# Altium project Carte_Alim_2019.PrjPcb (part 2 of 2)

## Sheet Carte_Alim_2019_CLAV.SchDoc
size A4; Author: Audran; CompanyName: Goldorak; Address1: Electrolab; Address2: 52 rue Paul Lescop; Address3: 92000 Nanterre; DocumentNumber: 5; SheetNumber: 5; SheetTotal: 5; ProjectName: Cartes_2017
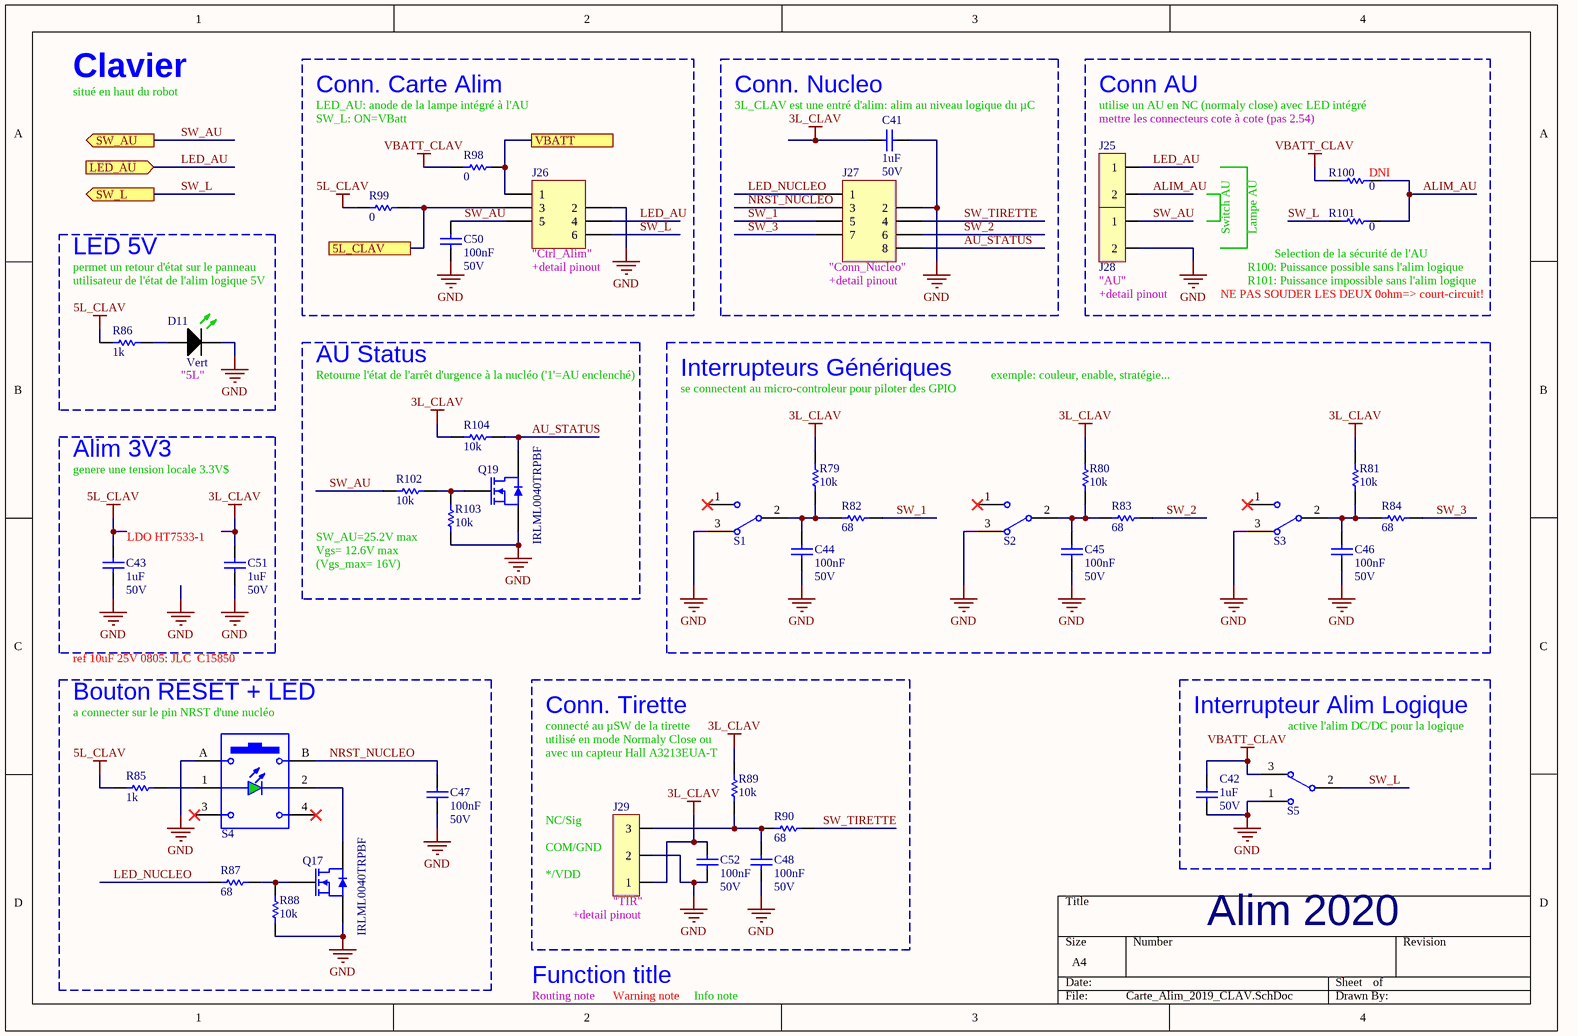
[diagram p4: Carte_Alim_2019_CLAV.SchDoc]

### Parts
C41  1uF  RatedVoltage: 50V  [WCAP-CSGP_0805, 2x1.25x1.25]
C42  1uF  RatedVoltage: 50V  [WCAP-CSGP_0805, 2x1.25x1.25]
C43  1uF  RatedVoltage: 50V  [WCAP-CSGP_0805, 2x1.25x1.25]
C44  100nF  RatedVoltage: 50V  [WCAP-CSGP_0603, 1.6x0.8x0.8]
C45  100nF  RatedVoltage: 50V  [WCAP-CSGP_0603, 1.6x0.8x0.8]
C46  100nF  RatedVoltage: 50V  [WCAP-CSGP_0603, 1.6x0.8x0.8]
C47  100nF  RatedVoltage: 50V  [WCAP-CSGP_0603, 1.6x0.8x0.8]
C48  100nF  RatedVoltage: 50V  [WCAP-CSGP_0603, 1.6x0.8x0.8]
C50  100nF  RatedVoltage: 50V  [WCAP-CSGP_0603, 1.6x0.8x0.8]
C51  1uF  RatedVoltage: 50V  [WCAP-CSGP_0805, 2x1.25x1.25]
C52  100nF  RatedVoltage: 50V  [WCAP-CSGP_0603, 1.6x0.8x0.8]
D11  Vert  [SMCW_0603]
J25  22-03-2021  [22-03-2021]  (value not drawn)
J26  690367280676  [690367280676]  (value not drawn)
J27  690367280876  [690367280876]  (value not drawn)
J28  22-03-2021  [22-03-2021]  (value not drawn)
J29  22-03-2031  [22-03-2031]  (value not drawn)
Q17  IRLML0040TRPBF  [SOT-23]
Q19  IRLML0040TRPBF  [SOT-23]
R79  value 10k  [RESC1608X06N]  (hidden comment: RC0603FR-0710KL)
R80  value 10k  [RESC1608X06N]  (hidden comment: RC0603FR-0710KL)
R81  value 10k  [RESC1608X06N]  (hidden comment: RC0603FR-0710KL)
R82  value 68  [RESC1608X06N]  (hidden comment: RC0603FR-0768RL)
R83  value 68  [RESC1608X06N]  (hidden comment: RC0603FR-0768RL)
R84  value 68  [RESC1608X06N]  (hidden comment: RC0603FR-0768RL)
R85  value 1k  [RESC1608X06N]  (hidden comment: RC0603FR-071KL)
R86  value 1k  [RESC1608X06N]  (hidden comment: RC0603FR-071KL)
R87  value 68  [RESC1608X06N]  (hidden comment: RC0603FR-0768RL)
R88  value 10k  [RESC1608X06N]  (hidden comment: RC0603FR-0710KL)
R89  value 10k  [RESC1608X06N]  (hidden comment: RC0603FR-0710KL)
R90  value 68  [RESC1608X06N]  (hidden comment: RC0603FR-0768RL)
R98  value 0  [RESC1608X06N]  (hidden comment: RC0603FR-070RL)
R99  value 0  [RESC1608X06N]  (hidden comment: RC0603FR-070RL)
R100  value 0  [RESC1608X06N]  (hidden comment: RC0603FR-070RL)
R101  value 0  [RESC1608X06N]  (hidden comment: RC0603FR-070RL)
R102  value 10k  [RESC1608X06N]  (hidden comment: RC0603FR-0710KL)
R103  value 10k  [RESC1608X06N]  (hidden comment: RC0603FR-0710KL)
R104  value 10k  [RESC1608X06N]  (hidden comment: RC0603FR-0710KL)
S1  OS102011MS2QN1  [SW_OS102011MS2QN1]  (value not drawn)
S2  OS102011MS2QN1  [SW_OS102011MS2QN1]  (value not drawn)
S3  OS102011MS2QN1  [SW_OS102011MS2QN1]  (value not drawn)
S4  440GS67082622  [440xx67082622]  (value not drawn)
S5  OS102011MS2QN1  [SW_OS102011MS2QN1]  (value not drawn)

### Blocks framed on the sheet
Conn. Carte Alim: C50 J26 R98 R99
Conn. Nucleo: C41 J27
Conn AU: J25 J28 R100 R101
LED 5V: D11 R86
AU Status: Q19 R102-R104
Interrupteurs Génériques: C44-C46 R79-R84 S1-S3
Alim 3V3: C43 C51
Bouton RESET + LED: C47 Q17 R85 R87 R88 S4
Conn. Tirette: C48 C52 J29 R89 R90
Interrupteur Alim Logique: C42 S5

### Ports
5L_CLAV, LED_AU (in), SW_AU (out), SW_L (out), VBATT

### Nets
3L_CLAV: C41.2 C51.1 C52.1 J29.1 R79.2 R80.2 R81.2 R89.2 R104.2
5L: J26.3 R99.1 ; port 5L_CLAV
5L_CLAV: C43.1 R85.1 R86.1 R99.2
GND: C41.1 C42.1 C43.2 C44.2 C45.2 C46.2 C47.2 C48.2 C50.2 C51.2 C52.2 D11.1(C) J26.2 J27.2 J28.2 J29.2 Q17.2(S) Q19.2(S) R88.1 R103.1 S1.3 S2.3 S3.3 S4.A S5.1
VBATT: J26.1 R98.1 ; port VBATT
VBATT_CLAV: C42.2 R98.2 R100.1 S5.3
ALIM_AU: J25.2 R100.2 R101.2
AU_STATUS: J27.8 Q19.3(D) R104.1
LED_AU: J25.1 J26.4 ; port LED_AU
LED_NUCLEO: J27.1 R87.1
NRST_NUCLEO: C47.1 J27.3 S4.B
SW_1: J27.5 R82.2
SW_2: J27.6 R83.2
SW_3: J27.7 R84.2
SW_AU: C50.1 J26.5 J28.1 R102.2 ; port SW_AU
SW_L: J26.6 R101.1 S5.2 ; port SW_L
SW_TIRETTE: J27.4 R90.2
NetC44_1: C44.1 R79.1 R82.1 S1.2
NetC45_1: C45.1 R80.1 R83.1 S2.2
NetC46_1: C46.1 R81.1 R84.1 S3.2
NetC48_1: C48.1 J29.3 R89.1 R90.1
NetD11_2: D11.2(A) R86.2
NetQ17_1: Q17.1(G) R87.2 R88.2
NetQ17_3: Q17.3(D) S4.2
NetQ19_1: Q19.1(G) R102.1 R103.2
NetR85_2: R85.2 S4.1

Not connected (* = marked no-connect by the designer): S1 1*; S2 1*; S3 1*; S4 3* 4*

### Notes on the sheet
- Clavier
- situé en haut du robot
- LED_AU: anode de la lampe intégré à l'AU
- (near C41) 3L_CLAV est une entré d'alim: alim au niveau logique du µC
- utilise un AU en NC (normaly close) avec LED intégré
- SW_L: ON=VBatt
- mettre les connecteurs cote à cote (pas 2.54)
- (near R100) DNI
- Switch AU
- Lampe AU
- permet un retour d'état sur le panneau
- utilisateur de l'état de l'alim logique 5V
- (near J26) "Ctrl_Alim"
- (near J26) +detail pinout
- (near J27) "Conn_Nucleo"
- (near J27) +detail pinout
- (near J28) "AU"
- (near J28) +detail pinout
- NE PAS SOUDER LES DEUX 0ohm=> court-circuit!
- (near R101) R100: Puissance possible sans l'alim logique
- R101: Puissance impossible sans l'alim logique
- (near R101) Selection de la sécurité de l'AU
- (near D11) "5L"
- Retourne l'état de l'arrêt d'urgence à la nucléo ('1'=AU enclenché)
- exemple: couleur, enable, stratégie...
- se connectent au micro-controleur pour piloter des GPIO
- genere une tension locale 3.3V$
- (near C43) LDO HT7533-1
- SW_AU=25.2V max
- Vgs= 12.6V max
- (Vgs_max= 16V)
- (near S4) a connecter sur le pin NRST d'une nucléo
- ref 10uF 25V 0805: JLC  C15850
- (near R89) connecté au µSW de la tirette
- (near R89) utilisé en mode Normaly Close ou
- (near R89) avec un capteur Hall A3213EUA-T
- (near S5) active l'alim DC/DC pour la logique
- (near J29) COM/GND
- NC/Sig
- */VDD
- (near J29) +detail pinout
- (near J29) "TIR"
- Function title
- Alim 2020
- Routing note
- Warning note
- Info note
- Title
- Size:
- Date:
- A4
- Number:
- Time:
- Revision:
- Sheet
- of
- File:

### Library data of the parts
C41-C43 C51 = WCAP-CSGP, 885012207103: CAP CER 1uF 50V X7R 0805; Manufacturer: Wurth Elektronik; PublishedDate: Aug 2016; ComponentLink1Description: Manufacturer; ComponentLink1URL: http://www.we-online.de; ComponentLink2Description: Datasheet; ComponentLink2URL: http://katalog.we-online.com/pbs/datasheet/885012207103.pdf; Manufacturer Part Number: 885012207103; Value: 1uF; Size: 0805; CeramicType: X7R
  C43 C51: Supplier 2: JLCPCB; Supplier Part Number 2: C28323
C44-C48 C50 C52 = WCAP-CSGP, 885012206095: CAP CER 100nF 50V X7R 0603; Manufacturer: Wurth Elektronik; PublishedDate: Aug 2016; ComponentLink1Description: Manufacturer; ComponentLink1URL: http://www.we-online.de; ComponentLink2Description: Datasheet; ComponentLink2URL: http://katalog.we-online.com/pbs/datasheet/885012206095.pdf; Value: 100nF; Size: 0603; CeramicType: X7R; Manufacturer Part Number: 885012206095
D11 = WL-SMCW 0603  150060GS75000: SMD mono-color Chip LED, WL-SMCW, Green; Manufacturer 1: Würth Elektronik eiSos GmbH; Manufacturer Part Number: 150060GS75000; ComponentLink1Description: Manufacturer; ComponentLink1URL: http://www.we-online.de; Created by: Christin Otto; Created Date: June 2013; ComponentLink2Description: Datasheet; ComponentLink2URL: http://katalog.we-online.com/led/datasheet/150060GS75000.pdf; Color: Green; Value: Vert; Supplier 1: Farnell; Supplier Part Number 1: 2322070
J25 J28 = 22-03-2021: Manufacturer 1: MOLEX; Supplier 1: Farnell; Supplier Part Number 1: 9731075; Manufacturer Part Number: 22-03-2021; Pricing: 10=0.189, 100=0.147, 200=0.119, 500=0.108, 1000=0.088, 2500=0.08, 2500=0.0711, 20000=0.064 (EUR); ComponentLink1URL: http://www.farnell.com/cad/1533907.pdf; ComponentLink1Description: http://www.farnell.com/cad/1533907.pdf; ComponentLink2URL: http://www.farnell.com/datasheets/1791308.pdf; ComponentLink2Description: http://www.farnell.com/datasheets/1791308.pdf
J26 = 690367280676: WR-MM 6p Female SMT Connector with Polarization; Manufacturer: Wurth Electronics Inc.; Value: 6; ComponentLink1Description: Datasheet; ComponentLink1URL: http://katalog.we-online.de/em/datasheet/69036728xx76.pdf; Manufacturer Part Number: 690367280676; Supplier 1: Farnell; Supplier Part Number 1: 1641849
J27 = 690367280876: WR-MM 8p Female SMT Connector with Polarization; Manufacturer: Wurth Electronics Inc.; Value: 8; Manufacturer Part Number: 690367280876; ComponentLink1Description: Datasheet; ComponentLink1URL: http://katalog.we-online.de/em/datasheet/69036728xx76.pdf; Supplier 1: Farnell; Supplier Part Number 1: 1641850
J29 = 22-03-2031: Manufacturer 1: MOLEX; Supplier 1: Farnell; Supplier Part Number 1: 9731083; Manufacturer Part Number: 22-03-2031; Pricing: 10=0.27, 100=0.242, 200=0.22, 500=0.208, 1000=0.202, 2500=0.196 (EUR); ComponentLink1URL: http://www.farnell.com/cad/1533907.pdf; ComponentLink1Description: http://www.farnell.com/cad/1533907.pdf; ComponentLink2URL: http://www.farnell.com/datasheets/1785732.pdf; ComponentLink2Description: http://www.farnell.com/datasheets/1785732.pdf
Q17 Q19 = IRLML0040: MOSFET N 40V 3.6A SOT23; Manufacturer: INTERNATIONAL RECTIFIER; Supplier 1: Farnell; Supplier Part Number 1: 1831088; Manufacturer Part Number: IRLML0040TRPBF; ComponentLink1Description: http://www.irf.com/product-info/datasheets/data/irlml0040pbf.pdf; ComponentLink1URL: http://www.irf.com/product-info/datasheets/data/irlml0040pbf.pdf
R79-R81 R88 R89 R102-R104 = RC0603FR-0710KL: RES SMD 10K OHM 1% 1/10W 0603; Manufacturer: Yageo; Power: 100mW; Vmax: 50V; Manufacturer Part Number: RC0603FR-0710KL; Type: Thick Film; ComponentLink1Description: Manufacturer; ComponentLink1URL: http://www.yageo.com/NewPortal/_en/index.jsp; ComponentLink2Description: Datasheet; ComponentLink2URL: http://www.farnell.com/datasheets/2167052.pdf; Supplier 1: Farnell; Supplier Part Number 1: 9238603; Precision: ±1%
R82-R84 R87 R90 = RC0603FR-0768RL: RES SMD 68 OHM 1% 1/10W 0603; Manufacturer: Yageo; Power: 100mW; Vmax: 50V; Manufacturer Part Number: RC0603FR-0768RL; Type: Thick Film; ComponentLink1Description: Manufacturer; ComponentLink1URL: http://www.yageo.com/NewPortal/_en/index.jsp; ComponentLink2Description: Datasheet; ComponentLink2URL: http://www.farnell.com/datasheets/1868787.pdf; Supplier 1: Farnell; Supplier Part Number 1: 9238344; Precision: ±1%
R85 R86 = RC0603FR-071KL: RES SMD 1K OHM 1% 1/10W 0603; Manufacturer: Yageo; Power: 100mW; Vmax: 50V; Manufacturer Part Number: RC0603FR-071KL; Type: Thick Film; ComponentLink1Description: Manufacturer; ComponentLink1URL: http://www.yageo.com/NewPortal/_en/index.jsp; ComponentLink2Description: Datasheet; ComponentLink2URL: http://www.farnell.com/datasheets/2167052.pdf; Precision: ±1%; Supplier 1: Farnell; Supplier Part Number 1: 9238484
R98-R101 = RC0603FR-070RL: RES SMD 0 OHM 1% 1/10W 0603; Manufacturer: Yageo; Power: 100mW; Vmax: 50V; ComponentLink1Description: Manufacturer; ComponentLink1URL: http://www.yageo.com/NewPortal/_en/index.jsp; ComponentLink2Description: Datasheet; ComponentLink2URL: http://www.farnell.com/datasheets/2167052.pdf; Manufacturer Part Number: RC0603FR-070RL; Type: Thick Film; Supplier 1: Farnell; Precision: ±1%; Supplier Part Number 1: 2309106; Supplier 2: JLCPCB; Supplier Part Number 2: C21189
S1-S3 S5 = OS102011MS2QN1: SWITCH SLIDE SPDT 0.1A 12V (500VDC max); Manufacturer: C & K COMPONENTS; Supplier 1: Farnell; Supplier Part Number 1: 1201430; Manufacturer Part Number: OS102011MS2QN1; ComponentLink2URL: https://www.ckswitches.com/media/1428/os.pdf; ComponentLink2Description: datasheet; ComponentLink1Description: manufacturer; ComponentLink1URL: https://www.ckswitches.com/products/switches/product-details/Slide/OS/OS102011MS2QN1/
S4 = 440GS67082622: WS-TATL Illuminated THT Tact Switch, Green; Manufacturer: Wurth Elektronik; Operation Force: 220gf; Rated Voltage: 12VDC; Rated Current: 50mA; ComponentLink1Description: Manufacturer; ComponentLink1URL: https://www.we-online.com/catalog/en/TATL_12X12_THT/?sq=440GS67082622#440GS67082622; ComponentLink2Description: Datasheet; ComponentLink2URL: https://katalog.we-online.com/em/datasheet/440GS67082622.pdf; Manufacturer Part Number: 440GS67082622; Emitting Color: Green; Supplier 1: Farnell; Supplier Part Number 1: 2402381

## Nets that join several sheets
5L: Carte_Alim_2019_TOP (J3.3 R12.2), Carte_Alim_2019_CAP (FB8.1), Carte_Alim_2019_TRACO (7 pins), Carte_Alim_2019_CLAV (J26.3 R99.1)
5P: Carte_Alim_2019_TOP (R10.2), Carte_Alim_2019_TRACO (7 pins)
12V: Carte_Alim_2019_TOP (R11.2), Carte_Alim_2019_TRACO (8 pins)
GND: Carte_Alim_2019_TOP (23 pins), Carte_Alim_2019_CAP (36 pins), Carte_Alim_2019_TRACO (37 pins), Carte_Alim_2019_MOT (40 pins), Carte_Alim_2019_CLAV (25 pins)
PWR: Carte_Alim_2019_TOP (10 pins), Carte_Alim_2019_CAP (FB7.1), Carte_Alim_2019_MOT (17 pins)
VBATT: Carte_Alim_2019_TOP (13 pins), Carte_Alim_2019_TRACO (6 pins), Carte_Alim_2019_CLAV (J26.1 R98.1)
LED_AU: Carte_Alim_2019_TOP (J3.4 Q6.3 R9.1), Carte_Alim_2019_CLAV (J25.1 J26.4)
SW_AU: Carte_Alim_2019_TOP (J3.5 R3.1), Carte_Alim_2019_TRACO (D2.1 D4.1), Carte_Alim_2019_CLAV (C50.1 J26.5 J28.1 R102.2)
SW_L: Carte_Alim_2019_TOP (J3.6), Carte_Alim_2019_TRACO (D6.1), Carte_Alim_2019_CLAV (J26.6 R101.1 S5.2)

## Assembly variants
PROD: not fitted C28 FB8 J1 J2 J4 J8 J9 J10 J11 J12 J13 J14 J17 J18 J25 J28 J33 J37 R25 R45 R51 R60 R72 R92 R94 R96 R100
BASE: not fitted C8 C9 C10 C11 C12 C13 C14 C15 C16 C17 C18 C19 C27 C28 D2 D3 D4 D5 D6 D7 DC1 DC2 DC3 FB7 FB8 J1 J2 J4 J5 J6 J7 J8 J9 J10 J11 J12 J13 J14 J17 J18 J25 J28 J31 J32 J33 J37 Q3 Q4 Q5 Q11 Q12 Q13 Q14 Q15 Q16 R17 R18 R19 R20 R21 R22 R23 R24 R25 R26 R55 R56 R57 R58 R59 R60 R61 R62 R63 R64 R65 R66 R67 R68 R69 R70 R71 R72 R73 R74 R75 R76 R77 R78 R92 R93 R94 R95 R96 R97 R100
12V et NPN(VBAT): not fitted C1 C2 C3 C4 C5 C6 C7 C12 C13 C14 C15 C16 C17 C18 C19 C20 C21 C22 C23 C24 C25 C26 C28 C29 C30 C31 C32 C33 C34 C35 C36 C37 C38 C39 C40 C41 C42 C43 C44 C45 C46 C47 C48 C49 C50 D1 D4 D5 D6 D7 D10 D11 D12 D14 DC2 DC3 DT2 F1 F2 FB8 J1 J2 J3 J8 J9 J10 J11 J12 J13 J14 J15 J16 J17 J18 J19 J20 J21 J22 J23 J24 J25 J26 J27 J28 J29 J30 J31 J32 J33 J34 J35 J37 Q1 Q2 Q3 Q5 Q6 Q7 Q8 Q9 Q10 Q17 R1 R2 R3 R4 R5 R6 R7 R8 R9 R10 R11 R12 R13 R14 R15 R16 R21 R22 R23 R24 R25 R26 R27 R28 R29 R30 R31 R32 R33 R34 R35 R36 R37 R38 R39 R40 R41 R42 R43 R44 R45 R46 R47 R48 R49 R50 R51 R52 R53 R54 R79 R80 R81 R82 R83 R84 R85 R86 R87 R88 R89 R90 R92 R94 R96 R98 R99 R100 R101 S1 S2 S3 S4 S5
5L et uSW(VBAT): not fitted C1 C2 C3 C4 C5 C6 C7 C8 C9 C10 C11 C12 C13 C14 C15 C20 C21 C22 C23 C24 C25 C26 C27 C29 C30 C31 C32 C33 C34 C35 C36 C37 C38 C39 C40 C41 C42 C43 C44 C45 C46 C47 C48 C49 C50 D1 D2 D3 D4 D5 D10 D11 D12 D14 DC1 DC2 DT2 F1 F2 FB7 J1 J2 J3 J4 J5 J6 J7 J8 J9 J12 J13 J14 J15 J16 J17 J18 J19 J20 J21 J22 J23 J24 J25 J26 J27 J28 J29 J30 J31 J33 J34 J35 J37 Q1 Q2 Q3 Q4 Q6 Q7 Q8 Q9 Q10 Q17 R1 R2 R3 R4 R5 R6 R7 R8 R9 R10 R11 R12 R13 R14 R15 R16 R17 R18 R19 R20 R21 R22 R23 R27 R28 R29 R30 R31 R32 R33 R34 R35 R36 R37 R38 R39 R40 R41 R42 R43 R44 R45 R46 R47 R48 R49 R50 R51 R52 R53 R54 R58 R59 R60 R70 R71 R72 R79 R80 R81 R82 R83 R84 R85 R86 R87 R88 R89 R90 R93 R95 R97 R98 R99 R100 R101 S1 S2 S3 S4 S5; alternate parts R61 -> RC0603FR-071K8L, R62 -> RC0603FR-071K8L, R63 -> RC0603FR-071K8L, R73 -> RC0603FR-071K8L, R74 -> RC0603FR-071K8L, R75 -> RC0603FR-071K8L
5P et AN(5V): not fitted C1 C2 C3 C4 C5 C6 C7 C8 C9 C10 C11 C16 C17 C18 C19 C20 C21 C22 C23 C24 C25 C26 C27 C29 C30 C31 C32 C33 C34 C35 C36 C37 C38 C39 C40 C41 C42 C43 C44 C45 C46 C47 C48 C49 C50 D1 D2 D3 D6 D7 D10 D11 D12 D14 DC1 DC3 DT2 F1 F2 FB7 J1 J2 J3 J4 J5 J6 J7 J10 J11 J12 J13 J14 J15 J16 J17 J18 J19 J20 J21 J22 J23 J24 J25 J26 J27 J28 J29 J30 J32 J33 J34 J35 J37 Q1 Q2 Q4 Q5 Q6 Q7 Q8 Q9 Q10 Q11 Q12 Q13 Q14 Q15 Q16 Q17 R1 R2 R3 R4 R5 R6 R7 R8 R9 R10 R11 R12 R13 R14 R15 R16 R17 R18 R19 R20 R24 R25 R26 R27 R28 R29 R30 R31 R32 R33 R34 R35 R36 R37 R38 R39 R40 R41 R42 R43 R44 R45 R46 R47 R48 R49 R50 R51 R52 R53 R54 R55 R56 R57 R58 R59 R60 R67 R68 R69 R70 R71 R72 R79 R80 R81 R82 R83 R84 R85 R86 R87 R88 R89 R90 R93 R95 R97 R98 R99 R100 R101 S1 S2 S3 S4 S5